# EAGLE schematic shield (EAGLE 7.6.0)
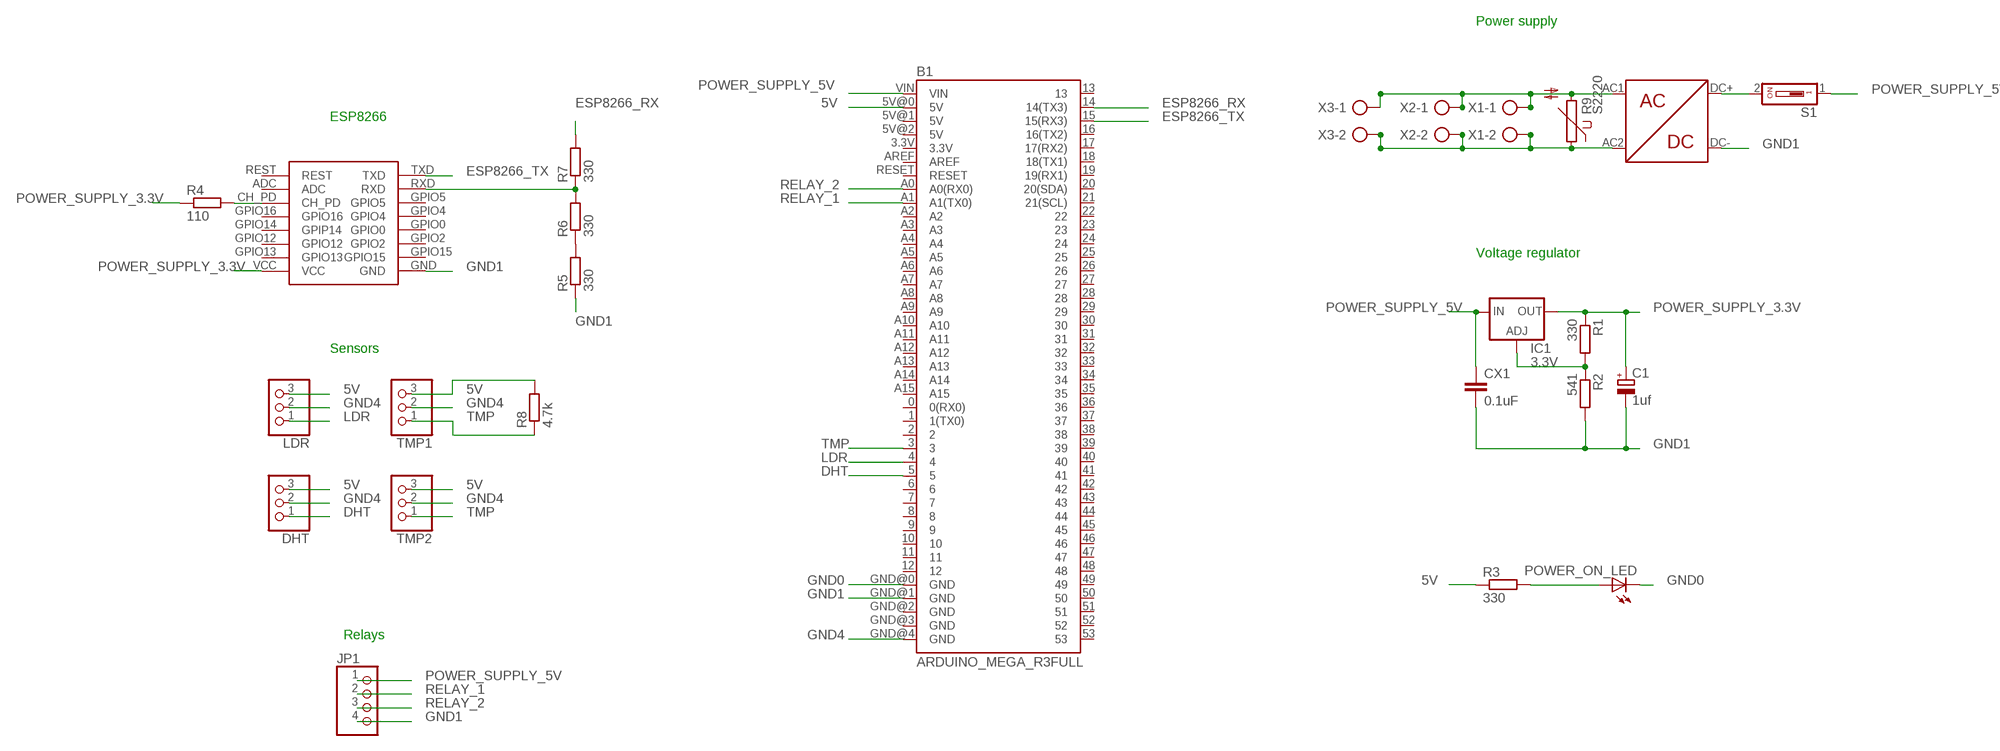
[diagram p0: schematic, sheet 1]

## Parts
B1  ARDUINO_MEGA_R3FULL  [ARDUINO_MEGA]
C1  1uf  CPOL-EUTT2D5  [TT2D5]
CX1  0.1uF  CXXC10B5  [XC10B5]
DHT  PINHD-1X3  [1X03]
IC1  3.3V  LM317TL  [317TL]
JP1  PINHD-1X4  [1X04]
LDR  PINHD-1X3  [1X03]
POWER_ON_LED  LED5MM  [LED5MM]
R1  330  R0204/7  [0204/7]
R2  541  R0204/7  [0204/7]
R3  330  R0204/7  [0204/7]
R4  110  R0204/7  [0204/7]
R5  330  R0204/7  [0204/7]
R6  330  R0204/7  [0204/7]
R7  330  R0204/7  [0204/7]
R8  4.7k  R0204/7  [0204/7]
R9  S2220  [S2220]
S1  SD4-01  [SD4-01]
TMP1  PINHD-1X3  [1X03]
TMP2  PINHD-1X3  [1X03]
U$1  HLK-PM01  [HLK-PM01]
U$4  ESP8266_SHIELD  [ESP8266_SHIELD]
X1  AK500/2-H  [AK500/2-H]
X2  AK500/2-H  [AK500/2-H]
X3  AK500/2-H  [AK500/2-H]

## Nets
5V: B1.5V@0(5V) DHT.3 LDR.3 R3.1 R8.2 TMP1.3 TMP2.3
DC+: S1.2 U$1.DC+
DHT: B1.5 DHT.1
ESP8266_RX: B1.14(14(TX3)) R7.2
ESP8266_TX: B1.15(15(RX3)) U$4.TXD
GND0: B1.GND@0(GND) POWER_ON_LED.K(C)
GND1: B1.GND@1(GND) C1.- CX1.2 JP1.4 R2.2 R5.1 U$1.DC- U$4.GND
GND4: B1.GND@4(GND) DHT.2 LDR.2 TMP1.2 TMP2.2
LDR: B1.4 LDR.1
N$2: R9.1 U$1.AC2 X1.2 X2.2 X3.2
N$3: POWER_ON_LED.A R3.2
N$4: IC1.1(ADJ) R1.2 R2.1
N$7: R5.2 R6.1
N$8: R6.2 R7.1 U$4.RXD
N$10: R9.2 U$1.AC1 X1.1 X2.1 X3.1
N$19: R4.2 U$4.CH_PD
POWER_SUPPLY_3.3V: C1.+ IC1.2(OUT) R1.1 R4.1 U$4.VCC
POWER_SUPPLY_5V: B1.VIN CX1.1 IC1.3(IN) JP1.1 S1.1
RELAY_1: B1.A1(A1(TX0)) JP1.2
RELAY_2: B1.A0(A0(RX0)) JP1.3
TMP: B1.3 R8.1 TMP1.1 TMP2.1
Unconnected: B1.0(0(RX0)) B1.1(1(TX0)) B1.2 B1.3.3V B1.5V@1(5V) B1.5V@2(5V) B1.6 B1.7 B1.8 B1.9 B1.10 B1.11 B1.12 B1.13 B1.16(16(TX2)) B1.17(17(RX2)) B1.18(18(TX1)) B1.19(19(RX1)) B1.20(20(SDA)) B1.21(21(SCL)) B1.22 B1.23 B1.24 B1.25 B1.26 B1.27 B1.28 B1.29 B1.30 B1.31 B1.32 B1.33 B1.34 B1.35 B1.36 B1.37 B1.38 B1.39 B1.40 B1.41 B1.42 B1.43 B1.44 B1.45 B1.46 B1.47 B1.48 B1.49 B1.50 B1.51 B1.52 B1.53 B1.A2 B1.A3 B1.A4 B1.A5 B1.A6 B1.A7 B1.A8 B1.A9 B1.A10 B1.A11 B1.A12 B1.A13 B1.A14 B1.A15 B1.AREF B1.GND@2(GND) B1.GND@3(GND) B1.RESET U$4.ADC U$4.GPIO0 U$4.GPIO2 U$4.GPIO4 U$4.GPIO5 U$4.GPIO12 U$4.GPIO13 U$4.GPIO14(GPIP14) U$4.GPIO15 U$4.GPIO16 U$4.REST

## Notes on the sheet
- Power supply
- ESP8266
- Voltage regulator
- Sensors
- Relays

## Library data of the parts
B1 = SparkFun-Boards:ARDUINO_MEGA_R3: Arduino Mega R3 ATmega2560 R3 compatible footprint. SparkFun Products: Arduino Mega 2560 R3 <https://www.sparkfun.com/products/11061>
C1 = rcl:CPOL-EU: POLARIZED CAPACITOR, European symbol
CX1 = resistor:CX: X CAPACITOR for power line
DHT LDR TMP1 TMP2 = pinhead:PINHD-1X3: PIN HEADER
IC1 = v-reg:LM317TL: VOLTAGE REGULATOR
JP1 = pinhead:PINHD-1X4: PIN HEADER
POWER_ON_LED = led:LED: LED OSRAM: - CHIPLED LG R971, LG N971, LY N971, LG Q971, LY Q971, LO R971, LY R971 LH N974, LH R974 LS Q976, LO Q976, LY Q976 LO Q996 - Hyper CHIPLED LW Q18S LB Q993, LB Q99A, LB R99A - SideLED LS A670, LO A670, LY A670, LG A670, LP A670 LB A673, LV A673, LT A673, LW A673 LH A674 LY A675 LS A676, LA A676, LO A676, LY A676, LW A676 LS A679, LY A679, LG A679 - Hyper Micro SIDELED® LS Y876, LA Y876, LO Y876, LY Y876 LT Y87S - SmartLED LW L88C, LW L88S LB L89C, LB L89S, LG L890 LS L89K, LO L89K, LY L89K LS L896, LA L896, LO L896, LY L896 - TOPLED LS T670, LO T670, LY T670, LG T670, LP T670 LSG T670, LSP T670, LSY T670, LOP T670, LYG T670 LG T671, LOG T671, LSG T671 LB T673, LV T673, LT T673, LW T673 LH T674 LS T676, LA T676, LO T676, LY T676, LB T676, LH T676, LSB T676, LW T676 LB T67C, LV T67C, LT T67C, LS T67K, LO T67K, LY T67K, LW E67C LS E67B, LA E67B, LO E67B, LY E67B, LB E67C, LV E67C, LT E67C LW T67C LS T679, LY T679, LG T679 LS T770, LO T770, LY T770, LG T770, LP T770 LB T773, LV T773, LT T773, LW T773 LH T774 LS E675, LA E675, LY E675, LS T675 LS T776, LA T776, LO T776, LY T776, LB T776 LHGB T686 LT T68C, LB T68C - Hyper Mini TOPLED® LB M676 - Mini TOPLED Santana® LG M470 LS M47K, LO M47K, LY M47K Source: http://www.osram.convergy.de LUXEON: - LUMILED® LXK2-PW12-R00, LXK2-PW12-S00, LXK2-PW14-U00, LXK2-PW14-V00 LXK2-PM12-R00, LXK2-PM12-S00, LXK2-PM14-U00 LXK2-PE12-Q00, LXK2-PE12-R00, LXK2-PE12-S00, LXK2-PE14-T00, LXK2-PE14-U00 LXK2-PB12-K00, LXK2-PB12-L00, LXK2-PB12-M00, LXK2-PB14-N00, LXK2-PB14-P00, LXK2-PB14-Q00 LXK2-PR12-L00, LXK2-PR12-M00, LXK2-PR14-Q00, LXK2-PR14-R00 LXK2-PD12-Q00, LXK2-PD12-R00, LXK2-PD12-S00 LXK2-PH12-R00, LXK2-PH12-S00 LXK2-PL12-P00, LXK2-PL12-Q00, LXK2-PL12-R00 Source: www.luxeon.com KINGBRIGHT: KA-3528ASYC Source: www.kingbright.com
R1-R8 = eagle-ltspice:R: RESISTOR, European symbol; SPICEMODEL: NONE; SPICEPREFIX: R
R9 = varistor:S2220: VARISTOR
S1 = switch-dil:SD4-01: DIL/CODE SWITCH; OC_FARNELL: unknown; OC_NEWARK: unknown
U$1 = ESP8266:HLK-PM01
U$4 = esp8266_shield:ESP8266_SHIELD
X1-X3 = con-ptr500:AK500/2-H: CONNECTOR Aug. 2004 / PTR Meßtechnik: Die Bezeichnung der Serie AK505 wurde geändert. Es handelt sich hierbei um AK500 in horizontaler Ausführung.; OC_FARNELL: unknown; OC_NEWARK: unknown